# EAGLE design untitled (EAGLE 7.7.0)
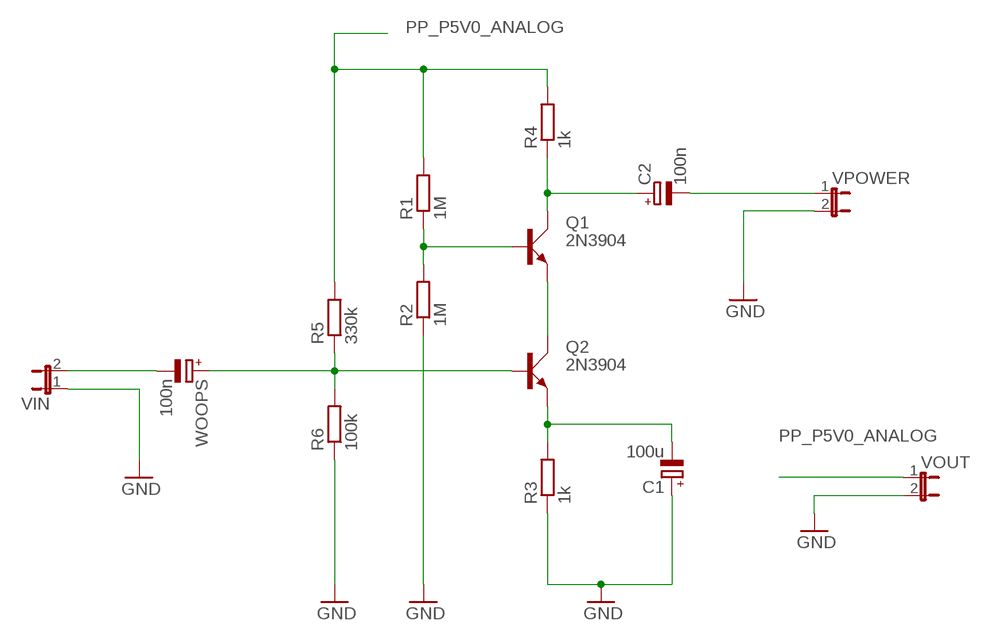
[diagram p0: schematic, sheet 1]

## Parts
C1  100u  CPOL-EUE5-10.5  [E5-10,5]
C2  100n  CPOL-EUE10-25  [EB25D]
Q1  2N3904  [TO92D]
Q2  2N3904  [TO92D]
R1  1M  R-EU_0207/10  [0207/10]
R2  1M  R-EU_0207/10  [0207/10]
R3  1k  R-EU_0207/10  [0207/10]
R4  1k  R-EU_0207/10  [0207/10]
R5  330k  R-EU_0207/10  [0207/10]
R6  100k  R-EU_0207/10  [0207/10]
VIN  JP1E  [JP1]
VOUT  JP1E  [JP1]
VPOWER  JP1E  [JP1]
WOOPS  100n  CPOL-EUE3.5-10  [E3,5-10]

## Nets
GND: C1.+ R2.1 R3.1 R6.1 VIN.1 VOUT.2 VPOWER.2
N$1: Q1.E Q2.C
N$2: C2.+ Q1.C R4.1
N$3: Q1.B R1.1 R2.2
N$4: VIN.2 WOOPS.-
N$6: Q2.B R5.1 R6.2 WOOPS.+
N$8: C1.- Q2.E R3.2
N$13: C2.- VPOWER.1
PP_P5V0_ANALOG: R1.2 R4.2 R5.2 VOUT.1

## Library data of the parts
C1 C2 = rcl:CPOL-EU: POLARIZED CAPACITOR, European symbol
Q1 Q2 = transistor-small-signal:2N3904: NPN TRANSISTOR
R1-R6 = rcl:R-EU_: RESISTOR, European symbol
VIN VOUT VPOWER = jumper:JP1E: JUMPER
WOOPS = resistor:CPOL-EU: POLARIZED CAPACITOR, European symbol

## Net classes
0 default: width 0.813 mm

## Board
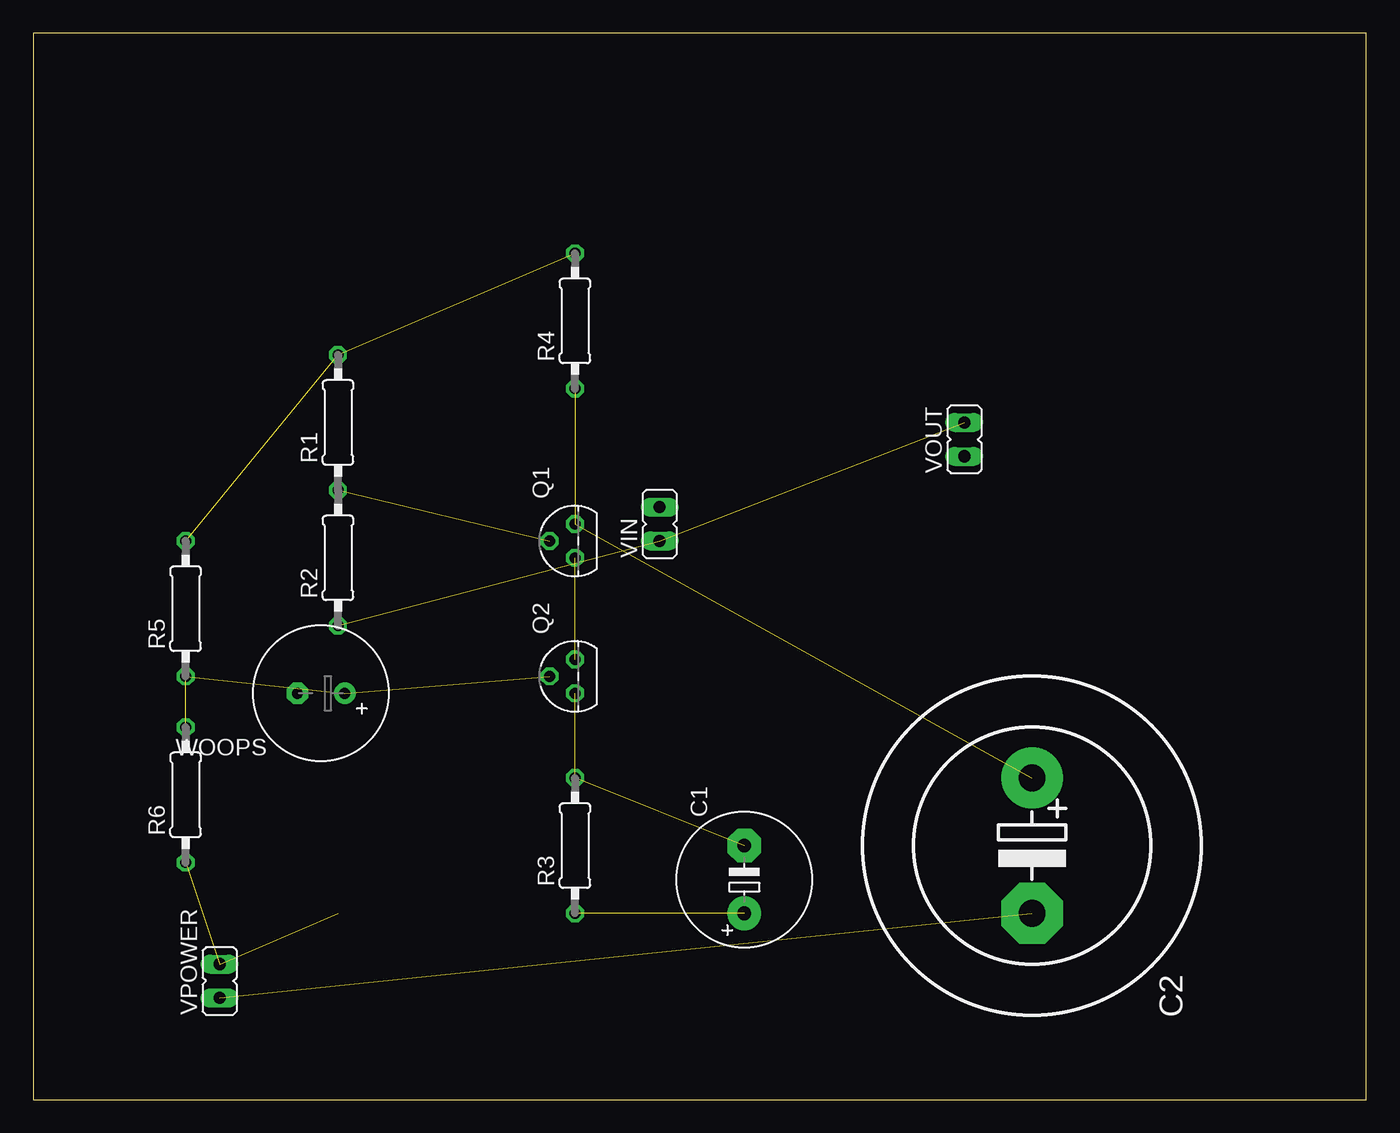
[diagram p1: board, top side]
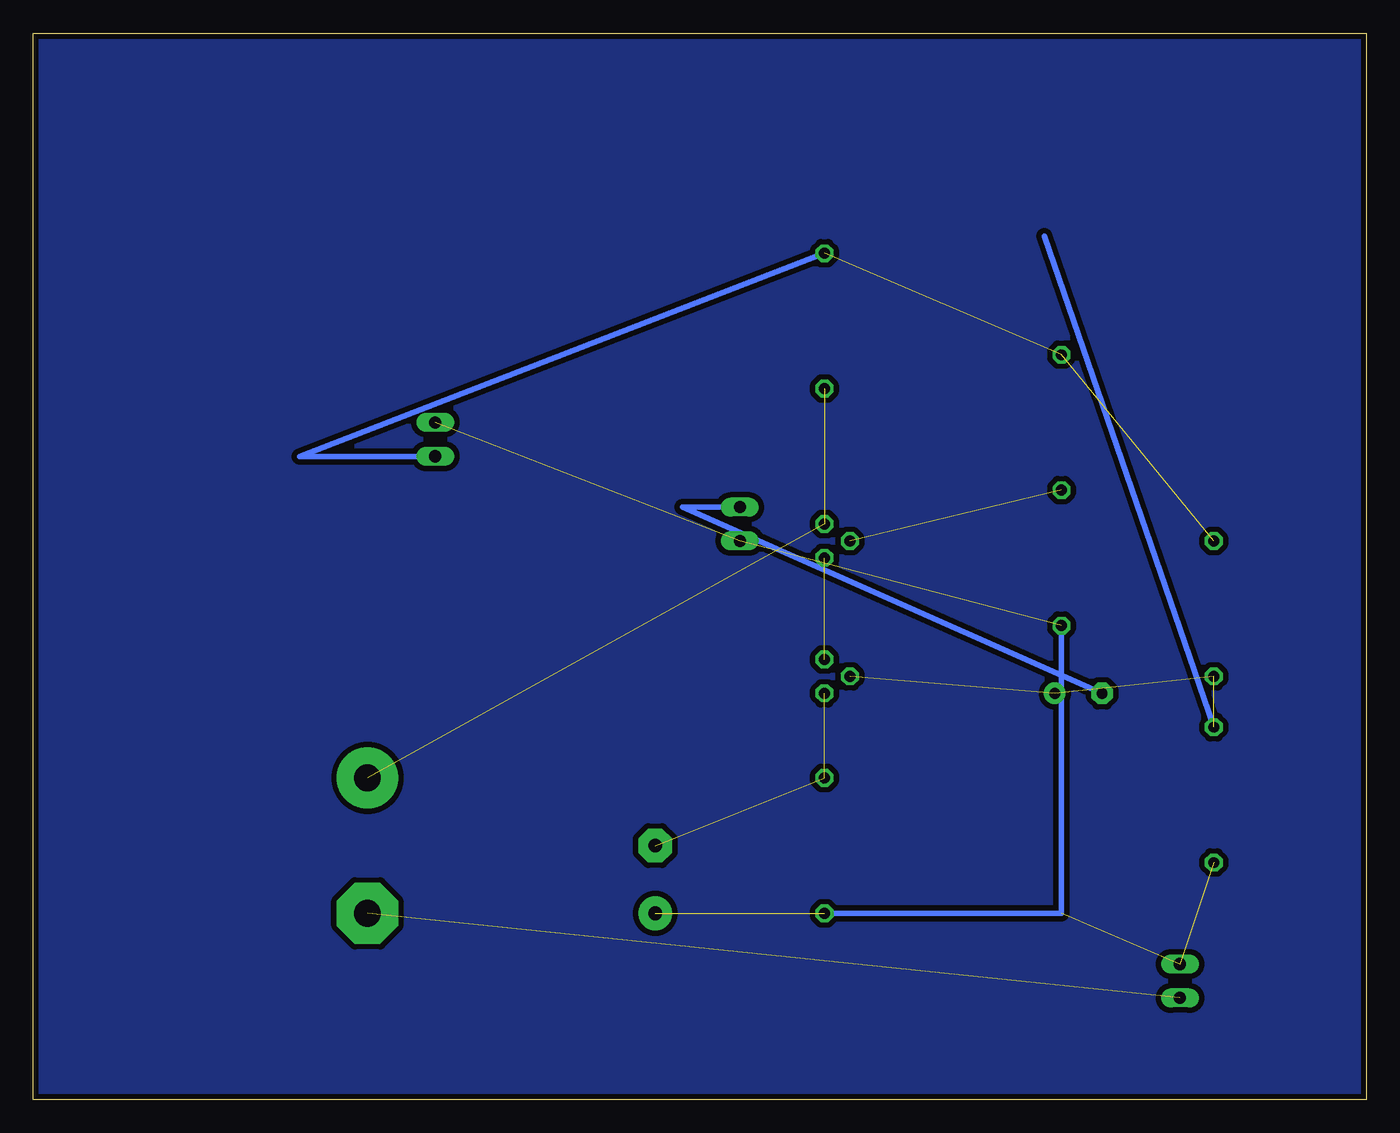
[diagram p2: board, bottom side, seen from below]

Size 100 x 80 mm. Coordinates in mm from the lower left corner, seen from the top.
Outline: 0,0 100,0 100,80 0,80 0,0
Copper layers (1*16): Top 0.035mm / dielectric 1.5mm / Bottom 0.035mm
Design rules "default *": minimum track width 16mil, minimum drill 24mil, track to track 16mil, track to pad 16mil, pad to pad 16mil, via to via 16mil, smd to smd 16mil, copper to edge 16mil, drill to drill 8mil, minimum pad ring 10mil, minimum via ring 8mil, stop-mask expansion 4mil, vias tented up to drill 0mil, thermal gap 10mil

### Footprints (pad centres in the part's own frame; a part is rotated, then mirrored left to right if it is on the bottom)
E5-10,5 = drill 1.016 pad 2.54: + -2.54,0 | drill 1.016 pad 2.54 octagon: - 2.54,0
EB25D = drill 2.007 pad 4.597: + -5.08,0 | drill 2.007 pad 4.597 octagon: - 5.08,0
TO92D = drill 0.813 octagon: B 0,1.905; C 1.27,0; E -1.27,0
0207/10 = drill 0.813 octagon: 1 -5.08,0; 2 5.08,0
JP1 = drill 0.914 long: 1 0,-1.27; 2 0,1.27
E3,5-10 = drill 0.813 pad 1.6: + -1.778,0 | drill 0.813 pad 1.6 octagon: - 1.778,0

### Placement (x,y rotation side)
C1  53.34,16.51 90 top
C2  74.93,19.05 270 top
Q1  40.64,41.91 90 top
Q2  40.64,31.75 90 top
R1  22.86,50.8 90 top
R2  22.86,40.64 90 top
R3  40.64,19.05 90 top
R4  40.64,58.42 90 top
R5  11.43,36.83 90 top
R6  11.43,22.86 90 top
VIN  46.99,43.18 0 top
VOUT  69.85,49.53 0 top
VPOWER  13.97,8.89 0 top
WOOPS  21.59,30.48 180 top

### Tracks (layer width: path | path; a pad name or v marks a point on that pad's centre or on a via)
GND  (5 unrouted)
  Bottom 0.406: R2.1 22.86,13.97 R3.1
N$1  (1 unrouted)
N$2  (2 unrouted)
N$3  (1 unrouted)
N$4
  Bottom 0.406: VIN.2 51.31,44.45 WOOPS.-
N$5
  pour Bottom: 0,80.01 100.33,80.01 100.33,0 0,0
N$6  (3 unrouted)
  Bottom 0.406: 24.13,64.77 R6.2
N$8  (2 unrouted)
N$13  (1 unrouted)
PP_P5V0_ANALOG  (2 unrouted)
  Bottom 0.406: VOUT.1 80.01,48.26 R4.2